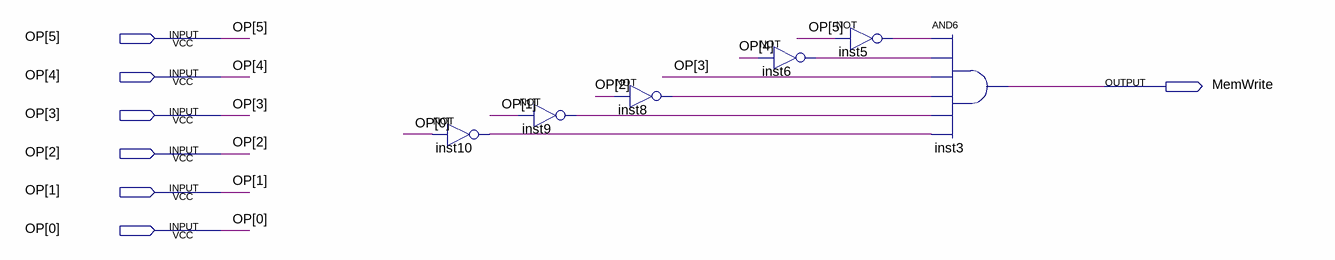
[diagram p0: schematic sheet]
// Quartus schematic Memwrite.bdf as structural Verilog: 6 symbols, 7 pins
module Memwrite (
  input  [5:0] OP,
  output MemWrite
);

  wire inst5_out, inst6_out, inst8_out, inst9_out, inst10_out;

  not inst10 (inst10_out, OP[0]);
  not inst9 (inst9_out, OP[1]);
  not inst8 (inst8_out, OP[2]);
  not inst6 (inst6_out, OP[4]);
  not inst5 (inst5_out, OP[5]);
  and inst3 (MemWrite, inst5_out, inst6_out, OP[3], inst8_out, inst9_out, inst10_out);
endmodule
